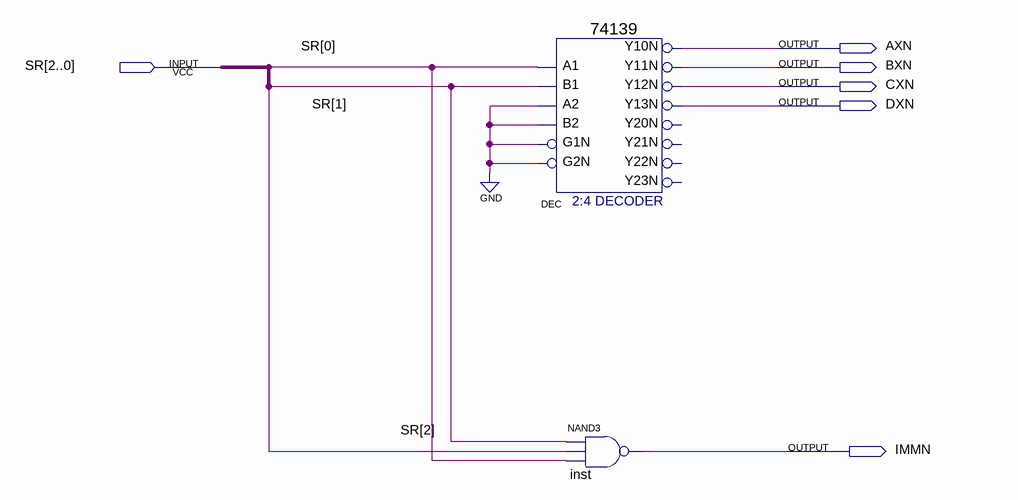
[diagram p0: schematic sheet]
// Quartus schematic COM-to-REAL.bdf as structural Verilog: 2 symbols, 6 pins
module \COM-to-REAL  (
  input  [2:0] SR,
  output AXN,
  output BXN,
  output CXN,
  output DXN,
  output IMMN
);

  \74139  DEC (
    .A1(SR[0]), .A2(1'b0), .B1(SR[1]), .B2(1'b0), .G1N(1'b0), .G2N(1'b0), .Y10N(AXN), .Y13N(DXN), .Y12N(CXN),
    .Y11N(BXN));  // open: Y20N, Y21N, Y22N, Y23N
  nand inst (IMMN, SR[1], SR[2], SR[0]);
endmodule
